# Altium schematic sheet MonitorAndMCUConn.SchDoc
size A4
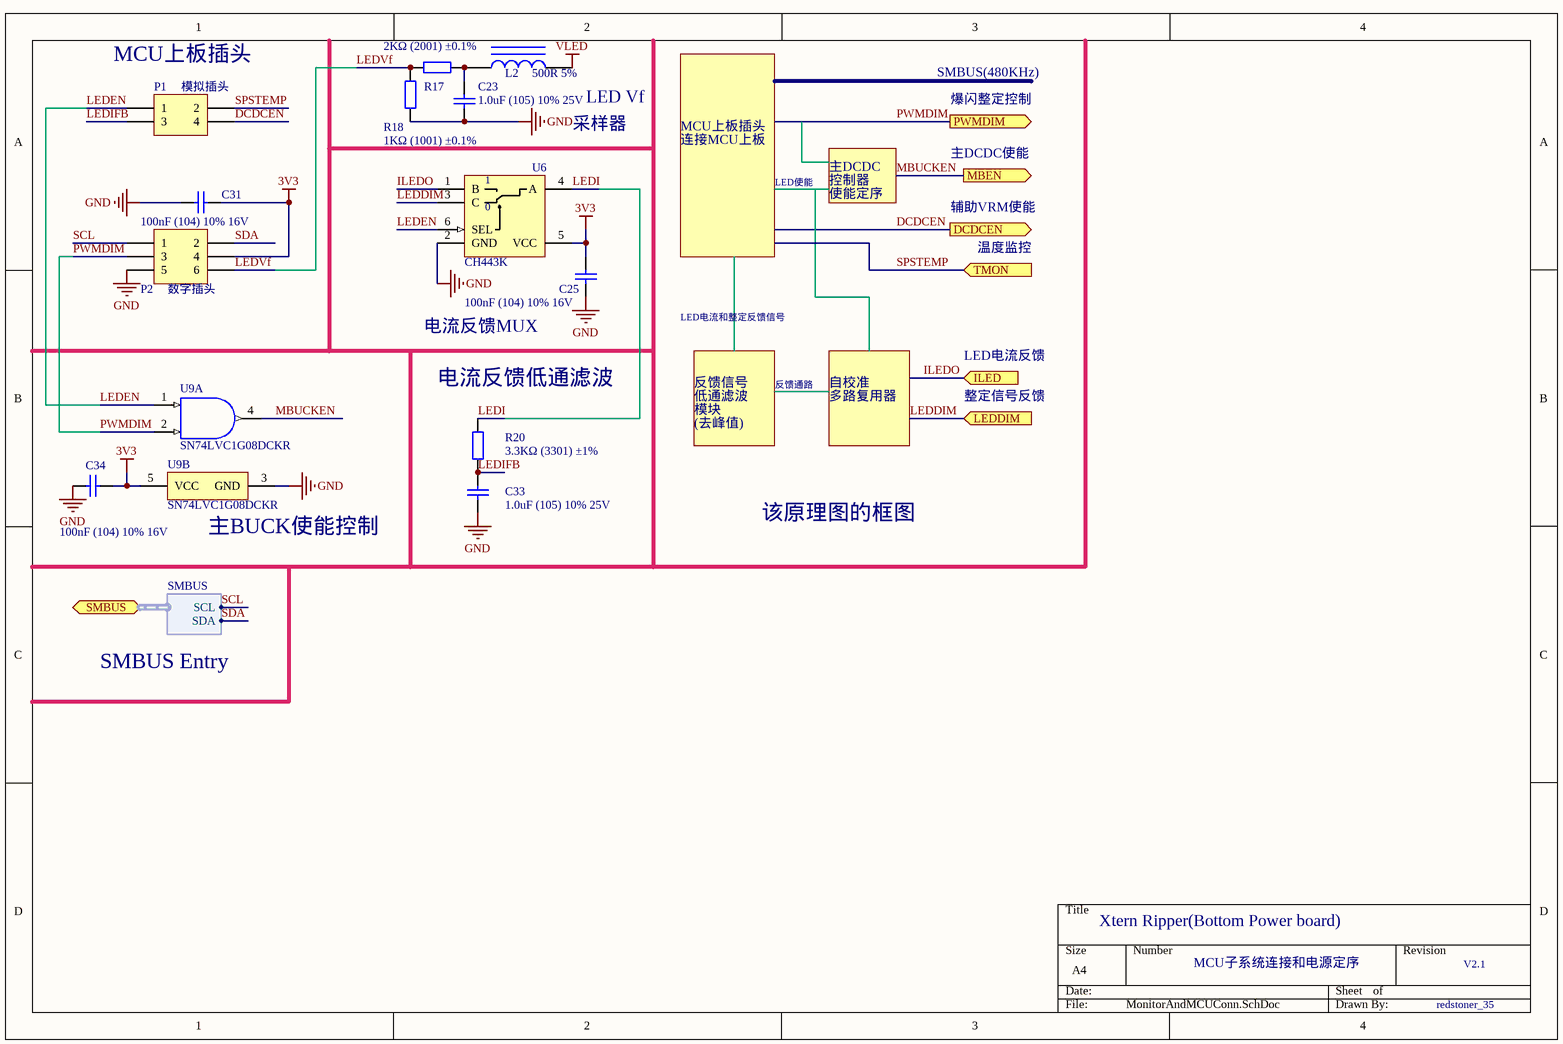
[diagram p0: MonitorAndMCUConn.SchDoc]

## Parts
C23  1.0uF (105) 10% 25V  [0402_C]
C25  100nF (104) 10% 16V  [0402_C]
C31  100nF (104) 10% 16V  [0402_C]
C33  1.0uF (105) 10% 25V  [0402_C]
C34  100nF (104) 10% 16V  [0402_C]
L2  500R 5%  [0402_L]
P1  模拟插头  [MHDR2X2]
P2  数字插头  [MHDR2X3]
R17  2KΩ (2001) ±0.1%  [0402_R]
R18  1KΩ (1001) ±0.1%  [0402_R]
R20  3.3KΩ (3301) ±1%  [0402_R]
U6  CH443K  [SC70-6]
U9  SN74LVC1G08DCKR  [DCK0005A_N]  (parts A,B of 2)

## Ports
DCDCEN (out), ILED (in), LEDDIM (in), MBEN (out), PWMDIM (out), SMBUS (harness SMBUS), TMON (in)

## Harnesses
SMBUS: SDA, SCL

## Nets
3V3: C25.2 C31.2 C34.2 P2.4 U6.5(VCC) U9.5(VCC)
GND: C23.1 C25.1 C31.1 C33.1 C34.1 P2.5 R18.1 U6.2(GND) U9.3(GND)
VLED: L2.1
DCDCEN: P1.4 ; port DCDCEN
ILEDO: U6.1(B) ; port ILED
LEDDIM: U6.3(C) ; port LEDDIM
LEDEN: P1.1 U6.6(SEL) U9.1(A)
LEDI: R20.2 U6.4(A)
LEDIFB: C33.2 P1.3 R20.1
LEDVf: P2.6 R17.2 R18.2
MBUCKEN: U9.4(Y) ; port MBEN
PWMDIM: P2.3 U9.2(B) ; port PWMDIM
SCL: P2.1 ; port SMBUS.SCL
SDA: P2.2 ; port SMBUS.SDA
SPSTEMP: P1.2 ; port TMON
NetC23_2: C23.2 L2.2 R17.1

## Notes on the sheet
- (near P1) MCU上板插头
- (near L2) LED Vf
- SMBUS(480KHz)
- 爆闪整定控制
- 采样器
- MCU上板插头
- 连接MCU上板
- LED使能
- 主DCDC
- 控制器
- 主DCDC使能
- 使能定序
- 辅助VRM使能
- 温度监控
- LED电流和整定反馈信号
- 电流反馈MUX
- (near R20) 电流反馈低通滤波
- 反馈信号
- 反馈通路
- 自校准
- LED电流反馈
- 低通滤波
- 模块
- (去峰值)
- 多路复用器
- 整定信号反馈
- 该原理图的框图
- (near U9) 主BUCK使能控制
- SMBUS Entry
- Xtern Ripper(Bottom Power board)
- MCU子系统连接和电源定序
- V2.1
- redstoner_35
- (in symbol NC7SB3157P6X) 0

## Library data of the parts
C23 C33 = 0402 1.0uF (105) 10% 25V: 贴片电容; ComponentLink1Description: 供应商链接; ComponentLink1URL: http://www.szlcsc.com/product/details_53938.html; Package: 0402; Supplier: LC; SuppliersPartNumber: C52923
C25 C31 C34 = 0402 100nF (104) 10% 16V: 贴片电容; ComponentLink1Description: 供应商链接; ComponentLink1URL: http://www.szlcsc.com/product/details_1877.html; Package: 0402; Supplier: LC; SuppliersPartNumber: C1525
L2 = 0402 27nH 5%: 贴片磁珠; ComponentLink1Description: 供应商链接; ComponentLink1URL: http://www.szlcsc.com/product/details_19533.html; Package: 0402; Supplier: LC; SuppliersPartNumber: C?????????
P1 = MHDR2X2: Header, 2-Pin, Dual row; LatestRevisionDate: 17-Jul-2002; LatestRevisionNote: Re-released for DXP Platform.; Publisher: Altium Limited
P2 = MHDR2X3: Header, 3-Pin, Dual row; LatestRevisionDate: 17-Jul-2002; LatestRevisionNote: Re-released for DXP Platform.; Publisher: Altium Limited
R17 = 0402 2KΩ (2001) 1%: 贴片电阻; ComponentLink1Description: 供应商链接; ComponentLink1URL: http://www.szlcsc.com/product/details_4516.html; Package: 0402; Supplier: LC; SuppliersPartNumber: C4109
R18 = 0402 1KΩ (1001) 1%: 贴片电阻; ComponentLink1Description: 供应商链接; ComponentLink1URL: http://www.szlcsc.com/product/details_12256.html; Package: 0402; Supplier: LC; SuppliersPartNumber: C11702
R20 = 0402 3.3KΩ (3301) 1%: 贴片电阻; ComponentLink1Description: 供应商链接; ComponentLink1URL: http://www.szlcsc.com/product/details_26633.html; Package: 0402; Supplier: LC; SuppliersPartNumber: C25890
U6 = NC7SB3157P6X: Low-Voltage Analog Switch SPDT,1.8-5V Power
U9 = SN74LVC1G08DCKR: Single 2-Input Positive-AND Gate, DCK0005A, LARGE T&R; Manufacturer: Texas Instruments; VCC(Min)(V): 1.65; VCC(Max)(V): 5.5; Output Type: CMOS; ICC @ Nom Voltage(Max)(mA): 0.01; Input Type: CMOS/TTL; Bits(#): 1; F @ Nom Voltage(Max)(Mhz): 150; Rating: Catalog; Technology Family: LVC; Voltage(Nom)(V): 1.8,2.5,3.3,5; Schmitt Trigger: No; Output Drive (IOL/IOH)(Max)(mA): 32/-32; tpd @ Nom Voltage(Max)(ns): 4.5,6,4,5; Logic: True; Gate Type: AND; DatasheetVersion: SCES217Y; PackageReference: DCK0005A; Supplier 1: Mouser; Supplier Part Number 1: 595-SN74LVC1G08DCKR; Supplier 2: Digi-Key; Supplier Part Number 2: 296-11602-2-ND; Supplier 3: Digi-Key; Supplier Part Number 3: 296-11602-1-ND; Supplier 4: Digi-Key; Supplier Part Number 4: 296-11602-6-ND; Generic Part Number: SN74LVC1G08; Operating Temperature Range(C): -40 to 125,-40 to 85; Sub-Family: AND Gate; 3-State Output: No; PartNumber: SN74LVC1G08DCKR; ComponentLink1Description: Manufacturer URL; ComponentLink1URL: http://www.ti.com/; ComponentLink2Description: Datasheet; ComponentLink2URL: http://www.ti.com/lit/ds/symlink/sn74lvc1g08.pdf